# Altium project 智能风扇原理图.PrjPCB
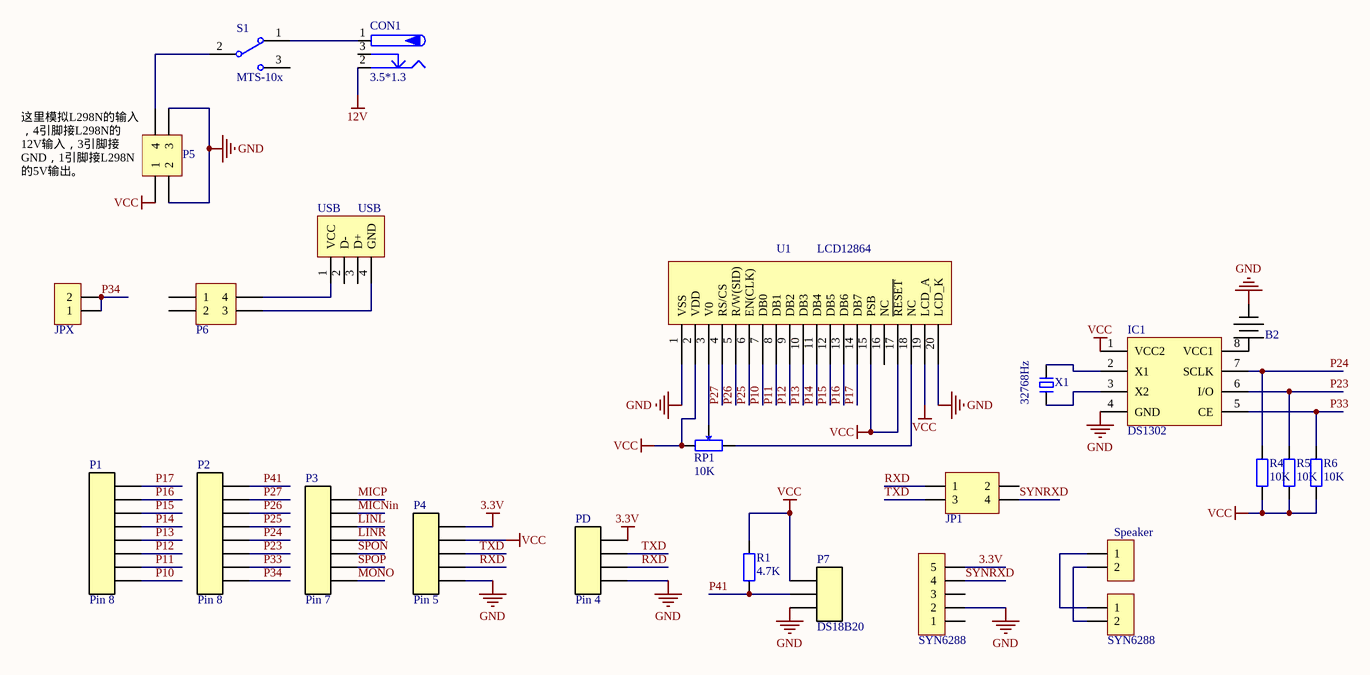
[diagram p0: 智能风扇原理图.SchDoc]
1 sheet, 25 parts. Net scope: global (net labels, ports and power ports of the same name join across sheets).
Board file: 智能语音风扇.PcbDoc

## Sheet 智能风扇原理图.SchDoc
size A3

### Parts
(Parts that share a designator on the sheet are numbered #1, #2 ... from top to bottom, then left to right.)
B2  Battery  [BAT-CR1220]  (value not drawn)
CON1  3.5*1.3  [DC-002]
IC1  DS1302  [SOP8_L]
JP1  Header2X2  [HDR2.54-LI-2x2P]  (value not drawn)
JPX  HDR-1X2  [HDR2.54-LI-2P]  (value not drawn)
P1  Pin 8  [HDRS2.54-1X8]
P2  Pin 8  [HDRS2.54-1X8]
P3  Pin 7  [HDRS2.54-1X7]
P4  Pin 5  [HDRS2.54-1X5]
P5  Header 2X2A  [HDR2X2_A]  (value not drawn)
P6  Header 2X2A  [HDR2X2_A]  (value not drawn)
P7  DS18B20  [HDRS2.54-1X3]
PD  Pin 4  [HDR2.54-1X4]
R1  4.7K  [RS 1/4W]
R4  10K  [RS 1/4W]
R5  10K  [RS 1/4W]
R6  10K  [RS 1/4W]
RP1  10K  [RM065]
S1  MTS-10x  [MTS-10x]
Speaker  HDR-1X2  [XH2.54-LI-2P]  (value not drawn)
SYN6288#1  HDR-1X2  [HDR2.54-M-LI-2P]  (value not drawn)
SYN6288#2  HDR-1X5  [HDR2.54-M-LI-5P]  (value not drawn)
U1  LCD12864  [LCD12864]
USB  USB  [USB-A/S_A]
X1  32768Hz  [OSC-2x6-WI-A]

### Nets
3.3V: P4.5 PD.4 SYN6288#2.5
12V: CON1.2
GND: B2.2 IC1.4(GND) P4.1 P5.2 P5.3 P7.3 PD.1 SYN6288#2.2 U1.1(VSS) U1.20(LCD_K)
VCC: IC1.1(VCC2) P4.4 P5.1 P7.1 R1.2 R4.1 R5.1 R6.1 RP1.1 U1.2(VDD) U1.15(PSB) U1.17(~{RESET}) U1.19(LCD_A)
LINL: P3.5
LINR: P3.4
MICNin: P3.6
MICP: P3.7
MONO: P3.1
P10: P1.8 U1.7(DB0)
P11: P1.7 U1.8(DB1)
P12: P1.6 U1.9(DB2)
P13: P1.5 U1.10(DB3)
P14: P1.4 U1.11(DB4)
P15: P1.3 U1.12(DB5)
P16: P1.2 U1.13(DB6)
P17: P1.1 U1.14(DB7)
P23: IC1.6(I/O) P2.3 R5.2
P24: IC1.7(SCLK) P2.4 R4.2
P25: P2.5 U1.6(EN(CLK))
P26: P2.6 U1.5(R/W(SID))
P27: P2.7 U1.4(RS/CS)
P33: IC1.5(CE) P2.2 R6.2
P34: JPX.1 JPX.2 P2.1
P41: P2.8 P7.2 R1.1
RXD: JP1.1 P4.2 PD.2
SPON: P3.3
SPOP: P3.2
SYNRXD: JP1.4 SYN6288#2.4
TXD: JP1.3 P4.3 PD.3
NetB2_1: B2.1 IC1.8(VCC1)
NetCON1_1: CON1.1 S1.1
NetIC1_2: IC1.2(X1) X1.2
NetIC1_3: IC1.3(X2) X1.1
NetP5_4: P5.4 S1.2
NetP6_3: P6.3 USB.4(GND)
NetP6_4: P6.4 USB.1(VCC)
NetRP1_2: RP1.2 U1.3(V0)
NetRP1_3: RP1.3 U1.18(NC)
NetSpeaker_1: Speaker.1 SYN6288#1.1
NetSpeaker_2: Speaker.2 SYN6288#1.2

Not connected (* = marked no-connect by the designer): CON1 3; JP1 2; P6 1 2; S1 3; SYN6288#2 1 3; U1 16(NC); USB 2(D-) 3(D+)

### Notes on the sheet
- (near P5) 这里模拟L298N的输入，4引脚接L298N的12V输入，3引脚接GND，1引脚接L298N的5V输出。

### Library data of the parts
B2 = Battery: 电池
CON1 = P-DC: 低压电源接口; BOM名称: DC电源接口; 版权归属: 源创客; 学习资源: www.ooocke.com
IC1 = DS1302: 实时时钟芯片; 版权归属: 源创客; BOM名称: 实时时钟芯片; 学习资源: www.ooocke.com
JP1 = Header 2X2: 2*2P接插件; 版权归属: 源创客; BOM名称: 2*2P接插件; 学习资源: www.ooocke.com
JPX Speaker SYN6288#1 = Header 2: 2P接插件; 版权归属: 源创客; BOM名称: 2P接插件; 学习资源: www.ooocke.com
P5 P6 = Header 2X2A: 接插件; LatestRevisionDate: 17-Jul-2002; LatestRevisionNote: Re-released for DXP Platform.; Publisher: Altium Limited
P7 = Pin 3
R1 R4-R6 = R-CRR: 直插色环电阻; BOM名称: 色环电阻; 版权归属: 源创客; 学习资源: www.ooocke.com
RP1 = RP-ID: 插件单联电位器; BOM名称: 插件电位器; 版权归属: 源创客; 学习资源: www.ooocke.com
S1 = MTS-10x: MTS10x系列3脚扭子开关; 版权归属: 源创客; BOM名称: MTS10x系列3脚扭子开关; 学习资源: www.ooocke.com
SYN6288#2 = Header 5: 5P接插件; 版权归属: 源创客; BOM名称: 5P接插件; 学习资源: www.ooocke.com
USB = USB-A/S: USB-A型母接口; 版权归属: 源创客; BOM名称: USB-A型母接口; 学习资源: www.ooocke.com
X1 = XTAL-2P: 2脚无源脚晶振; 版权归属: 源创客; BOM名称: 2脚无源脚晶振; 学习资源: www.ooocke.com